# EasyEDA Pro project ProPrj_遥控_2025-12-06.epro, schematic OLED_1
Board Name: OLED_1; Create Date: 2025-10-11; Page Name: P1; Project Name: 遥控; Schematic Name: OLED_1; Update Date: 2025-10-11; Company: 嘉立创EDA; Page Size: A4; Version: V1.0
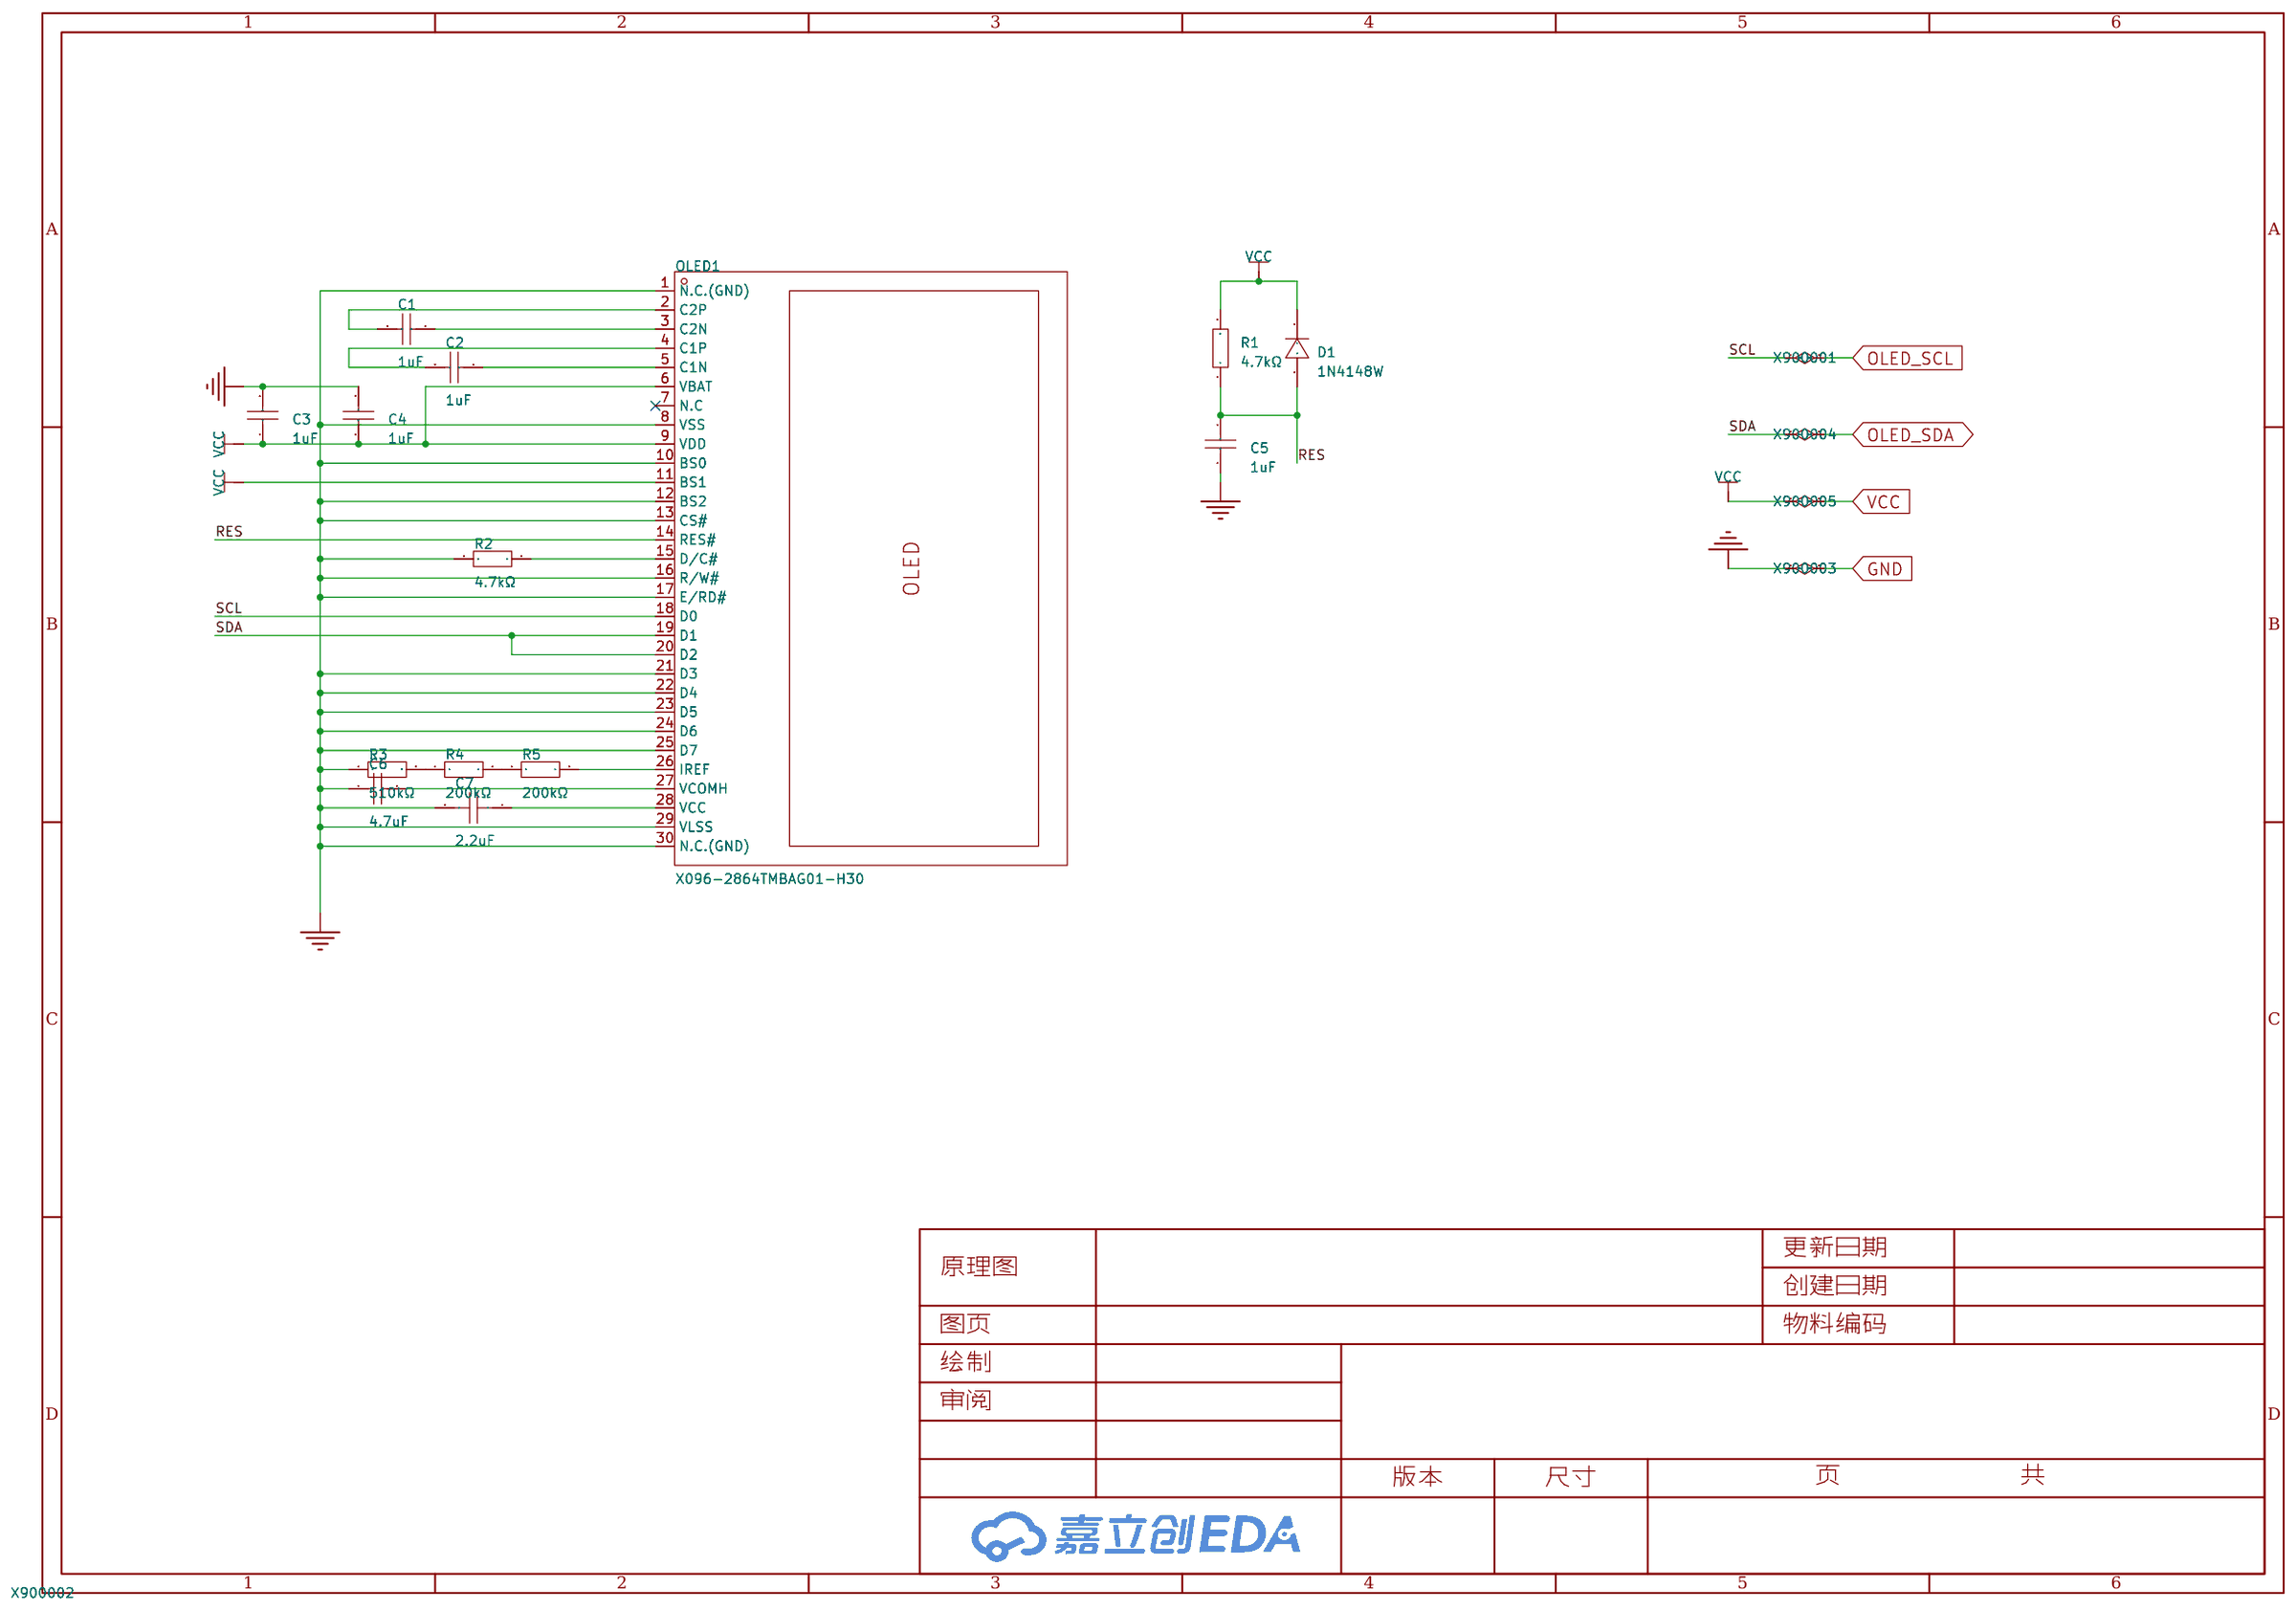
[diagram p4: schematic sheet]

## Parts
C1  1uF  [C0805]
C2  1uF  [C0805]
C3  1uF  [C0805]
C4  1uF  [C0805]
C5  1uF  [C0805]
C6  4.7uF  [C0805]
C7  2.2uF  [C0805]
D1  1N4148W  [SOD-123F_L2.7-W1.6-LS3.8-RD]
OLED1  X096-2864TMBAG01-H30  [OLED-SMD_X096-2864TMBAG01-H30]
R1  4.7kΩ  [R0805]
R2  4.7kΩ  [R0805]
R3  510kΩ  [R0603]
R4  200kΩ  [R0805]
R5  200kΩ  [R0805]

## Library data of the parts
C1-C5 = CL21B105KBFNNNE: 容值:1uF;精度:±10%;额定电压:50V;材质(温度系数):X7R;; LCSC Part Name: 1uF ±10% 50V; Supplier Part: C28323; Manufacturer: SAMSUNG(三星); Supplier Footprint: 0805; Datasheet: https://atta.szlcsc.com/upload/public/pdf/source/20160218/1457707763339.pdf; Supplier: LCSC; Tolerance: ±10%; Voltage Rated: 50V; Temperature Coefficient: X7R
C6 = CL21A475KAQNNNE: 容值:4.7uF;精度:±10%;额定电压:25V;材质(温度系数):X5R;; LCSC Part Name: 4.7uF ±10% 25V; Supplier Part: C1779; Manufacturer: SAMSUNG(三星); Supplier Footprint: 0805; Datasheet: https://atta.szlcsc.com/upload/public/pdf/source/20160218/1457707763339.pdf; Supplier: LCSC; Tolerance: ±10%; Voltage Rated: 25V; Temperature Coefficient: X5R
C7 = CL21A225KBQNNNE: 容值:2.2uF;精度:±10%;额定电压:50V;材质(温度系数):X5R;; LCSC Part Name: 2.2uF ±10% 50V; Supplier Part: C377773; Manufacturer: SAMSUNG(三星); Supplier Footprint: 0805; Datasheet: https://atta.szlcsc.com/upload/public/pdf/source/20160218/1457707763339.pdf; Supplier: LCSC; Tolerance: ±10%; Voltage Rated: 50V; Temperature Coefficient: X5R
D1 = 1N4148W_C81598: 二极管配置:独立式;正向压降(Vf):1V@50mA;直流反向耐压(Vr):75V;平均整流电流(Io):150mA;功率:400mW;反向恢复时间(trr):4ns;; LCSC Part Name: 电压:75V 电流:150mA; Supplier Part: C81598; Manufacturer: ST(先科); Supplier Footprint: SOD-123; Datasheet: https://atta.szlcsc.com/upload/public/pdf/source/20161024/1477288446905.pdf; Supplier: LCSC; Diode Configuration: 独立式; Forward Voltage (Vf@If): 1V@50mA; Reverse Voltage (Vr): 75V; Average Rectified Current (Io): 150mA; Power Dissipation: 400mW; Reverse Leakage Current: 1uA@75V; Reverse Recovery Time (trr): 4ns
OLED1 = X096-2864TMBAG01-H30: 主控芯片:SSD1315;尺寸(inch):0.96;像素分辨率:128x64;; LCSC Part Name: 0.96寸 双色 128x64像素分辨率 30PIN; Supplier Part: C5123564; Manufacturer: Newvision(新智景); Datasheet: https://atta.szlcsc.com/upload/public/pdf/source/20220805/961F239C9972248F1BA6CB14EF6A2C15.pdf; Supplier: LCSC; Main Control Chip: SSD1315; Size: 0.96; Pixel Resolution: 128x64
R1 R2 = 0805W8F4701T5E: 电阻类型:厚膜电阻;阻值:4.7kΩ;精度:±1%;功率:125mW;最大工作电压:150V;温度系数:±100ppm/℃;; LCSC Part Name: 4.7kΩ ±1% 125mW 厚膜电阻; Supplier Part: C17673; Manufacturer: UNI-ROYAL(厚声); Supplier Footprint: 0805; JLCPCB Part Class: 基础库; Datasheet: https://atta.szlcsc.com/upload/public/pdf/source/20200306/C422600_1E6D84923E4A46A82E41ADD87F860B5C.pdf; Supplier: LCSC; Type: 厚膜电阻; Tolerance: ±1%; Power(Watts): 125mW; Overload Voltage (Max): 150V; Temperature Coefficient: ±100ppm/℃; Operating Temperature Range: -55℃~+155℃
R3 = 0603WAF5103T5E: 电阻类型:厚膜电阻;阻值:510kΩ;精度:±1%;功率:100mW;最大工作电压:75V;温度系数:±100ppm/℃;; LCSC Part Name: 510kΩ ±1% 100mW 厚膜电阻; Supplier Part: C23192; Manufacturer: UNI-ROYAL(厚声); Supplier Footprint: 0603; Datasheet: https://atta.szlcsc.com/upload/public/pdf/source/20200306/C422600_1E6D84923E4A46A82E41ADD87F860B5C.pdf; Supplier: LCSC; Type: 厚膜电阻; Tolerance: ±1%; Power(Watts): 100mW; Overload Voltage (Max): 75V; Temperature Coefficient: ±100ppm/℃; Operating Temperature Range: -55℃~+155℃
R4 R5 = 0805W8F2003T5E: 电阻类型:厚膜电阻;阻值:200kΩ;精度:±1%;功率:125mW;最大工作电压:150V;温度系数:±100ppm/℃;; LCSC Part Name: 200kΩ ±1% 125mW 厚膜电阻; Supplier Part: C17539; Manufacturer: UNI-ROYAL(厚声); Supplier Footprint: 0805; Datasheet: https://atta.szlcsc.com/upload/public/pdf/source/20200306/C422600_1E6D84923E4A46A82E41ADD87F860B5C.pdf; Supplier: LCSC; Type: 厚膜电阻; Tolerance: ±1%; Power(Watts): 125mW; Overload Voltage (Max): 150V; Temperature Coefficient: ±100ppm/℃; Operating Temperature Range: -55℃~+155℃

## Nets
GND: C3.2 C4.2 C5.2 C6.1 C7.2 OLED1.1(N.C.(GND)) OLED1.8(VSS) OLED1.10(BS0) OLED1.12(BS2) OLED1.13(CS#) OLED1.16(R/W#) OLED1.17(E/RD#) OLED1.21(D3) OLED1.22(D4) OLED1.23(D5) OLED1.24(D6) OLED1.25(D7) OLED1.29(VLSS) OLED1.30(N.C.(GND)) R2.2 R3.1
VCC: C3.1 C4.1 D1.1(K) OLED1.6(VBAT) OLED1.9(VDD) OLED1.11(BS1) R1.2
OLED_SCL: OLED1.18(D0)
OLED_SDA: OLED1.19(D1) OLED1.20(D2)
RES: C5.1 D1.2(A) OLED1.14(RES#) R1.1
$1N581: C7.1 OLED1.28(VCC)
$1N735: C6.2 OLED1.27(VCOMH)
$1N818: OLED1.26(IREF) R5.2
$1N1344: C2.1 OLED1.5(C1N)
$1N1347: C1.1 OLED1.3(C2N)
$1N1351: C2.2 OLED1.4(C1P)
$1N1361: C1.2 OLED1.2(C2P)
$1N2501: R3.2 R4.1
$1N2540: R4.2 R5.1
$1N3248: OLED1.15(D/C#) R2.1

Not connected (* = marked no-connect by the designer): OLED1 7(N.C)*
